# Altium schematic sheet 通讯转换模块-V5.SchDoc
size 635 x 635 mm
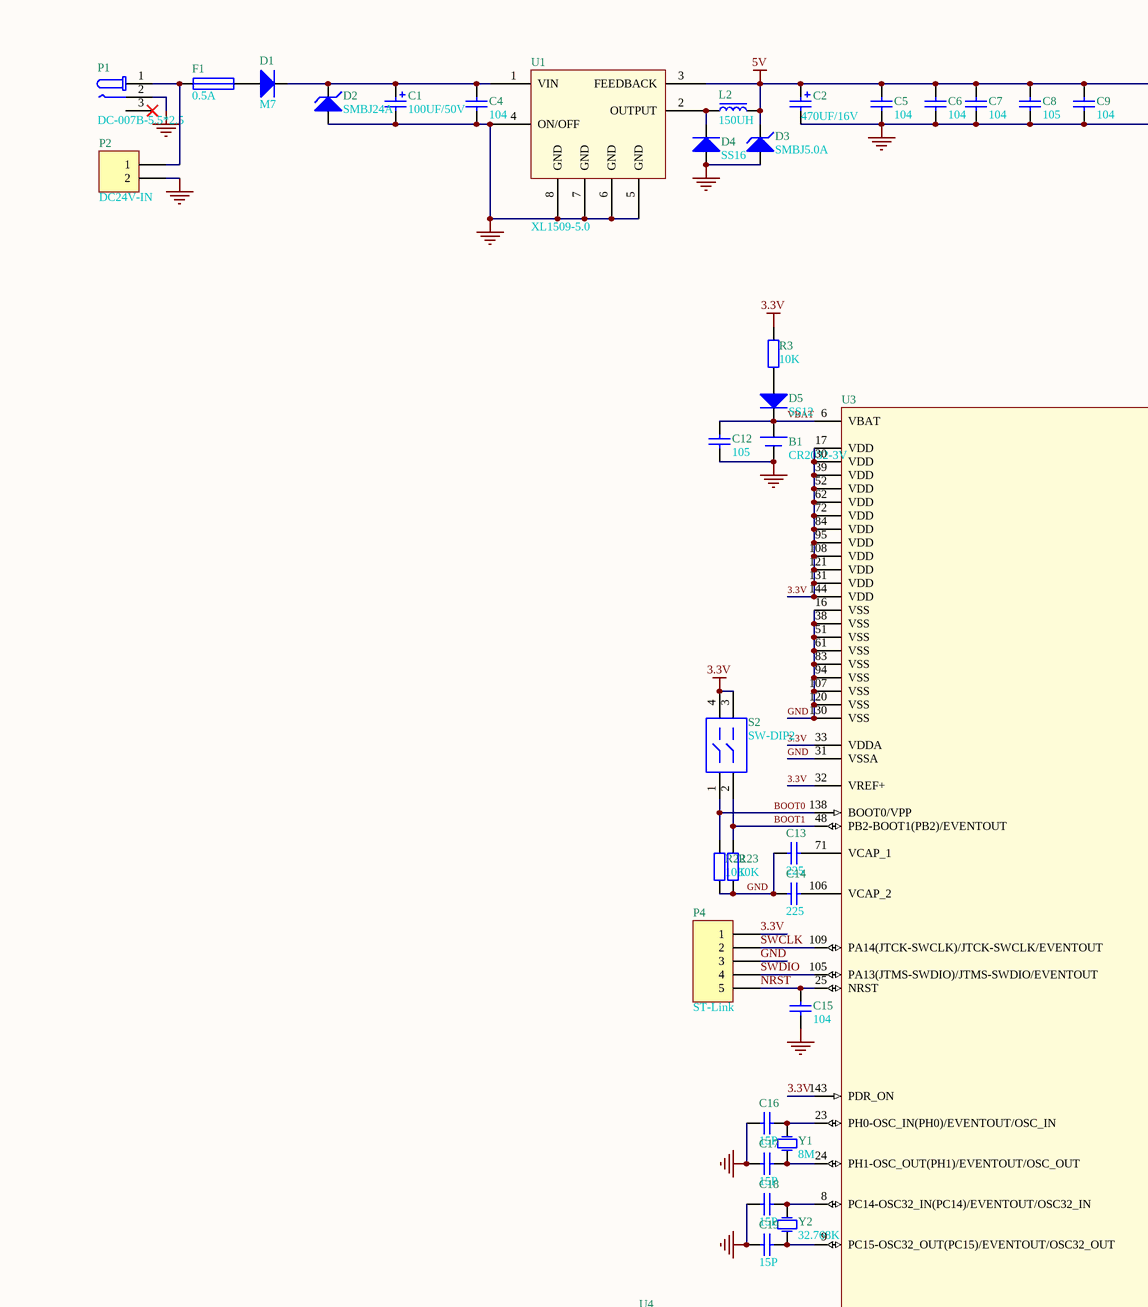
[diagram p0: 通讯转换模块-V5.SchDoc, top left]
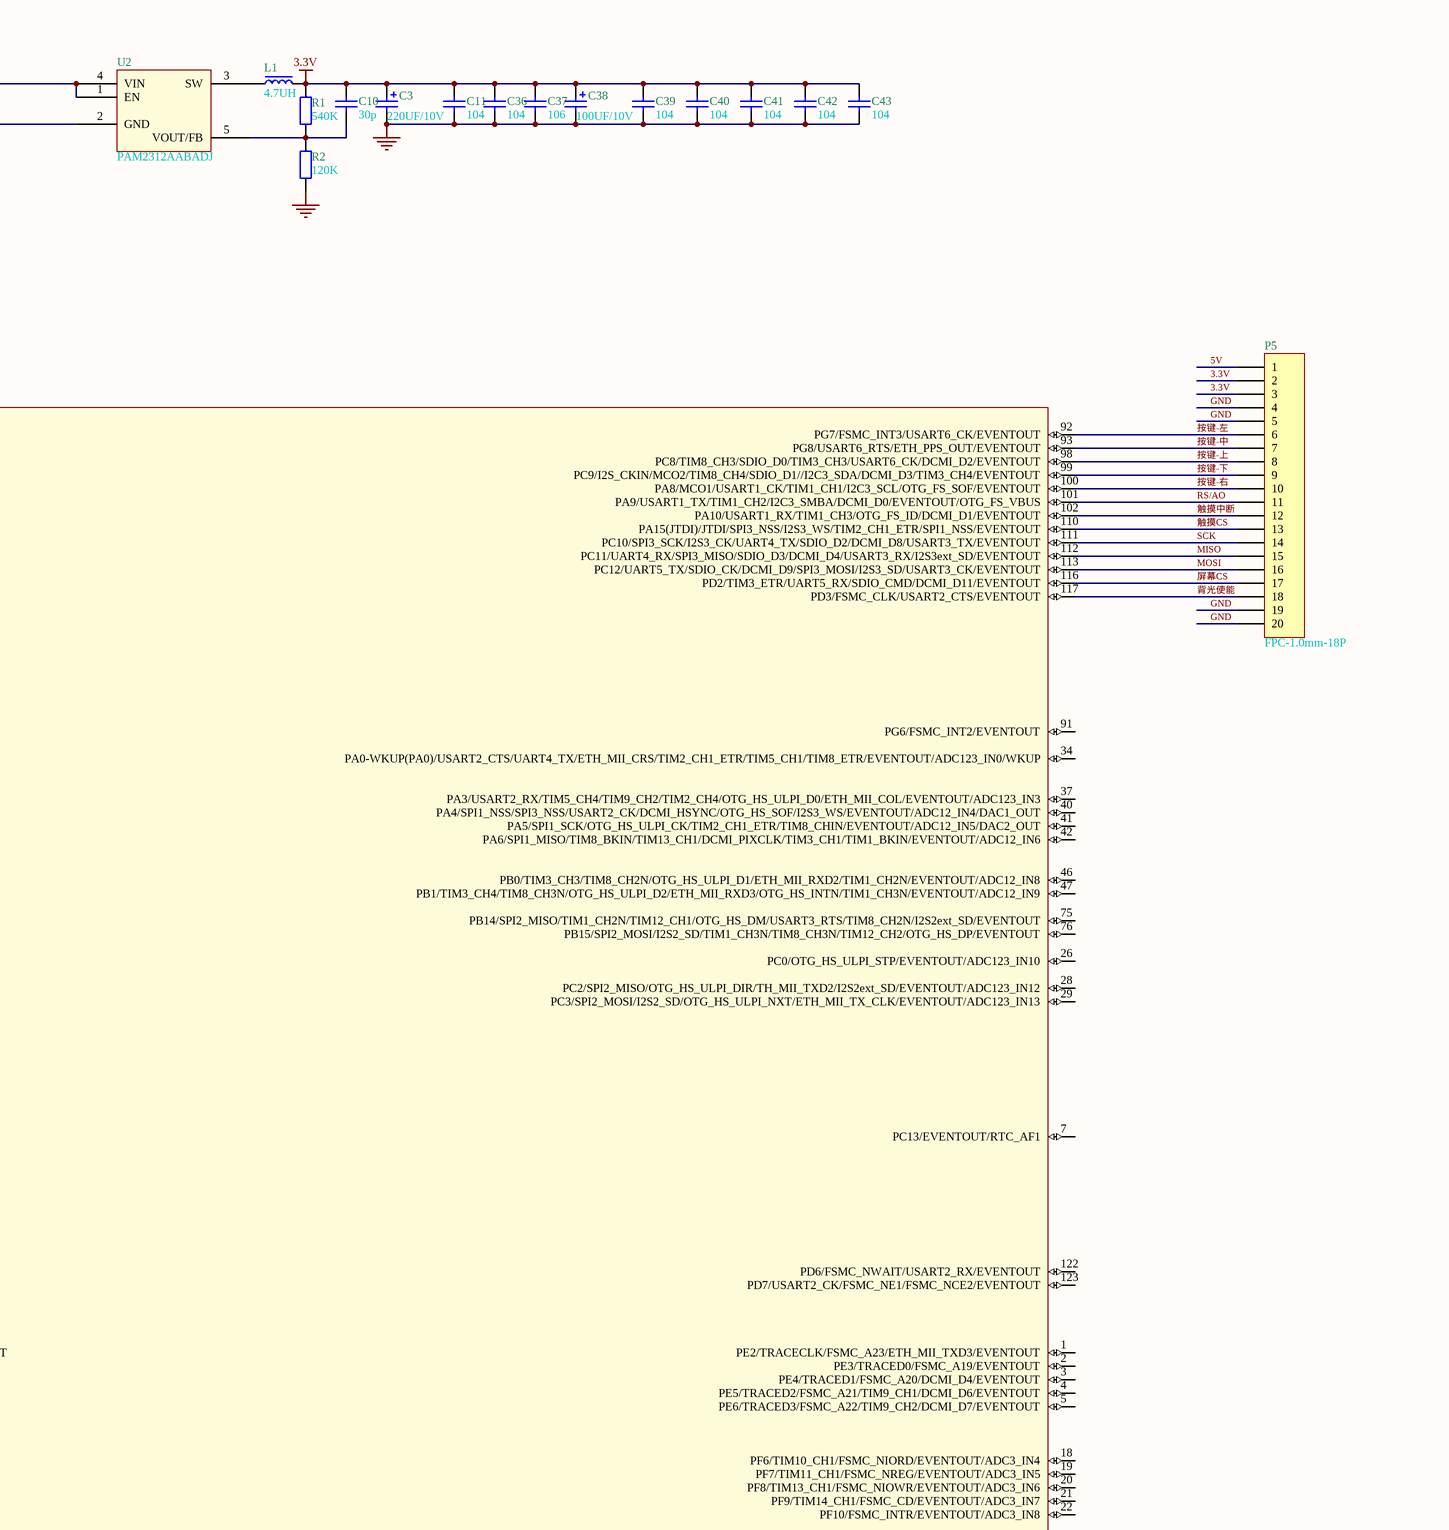
[diagram p1: 通讯转换模块-V5.SchDoc, top right]
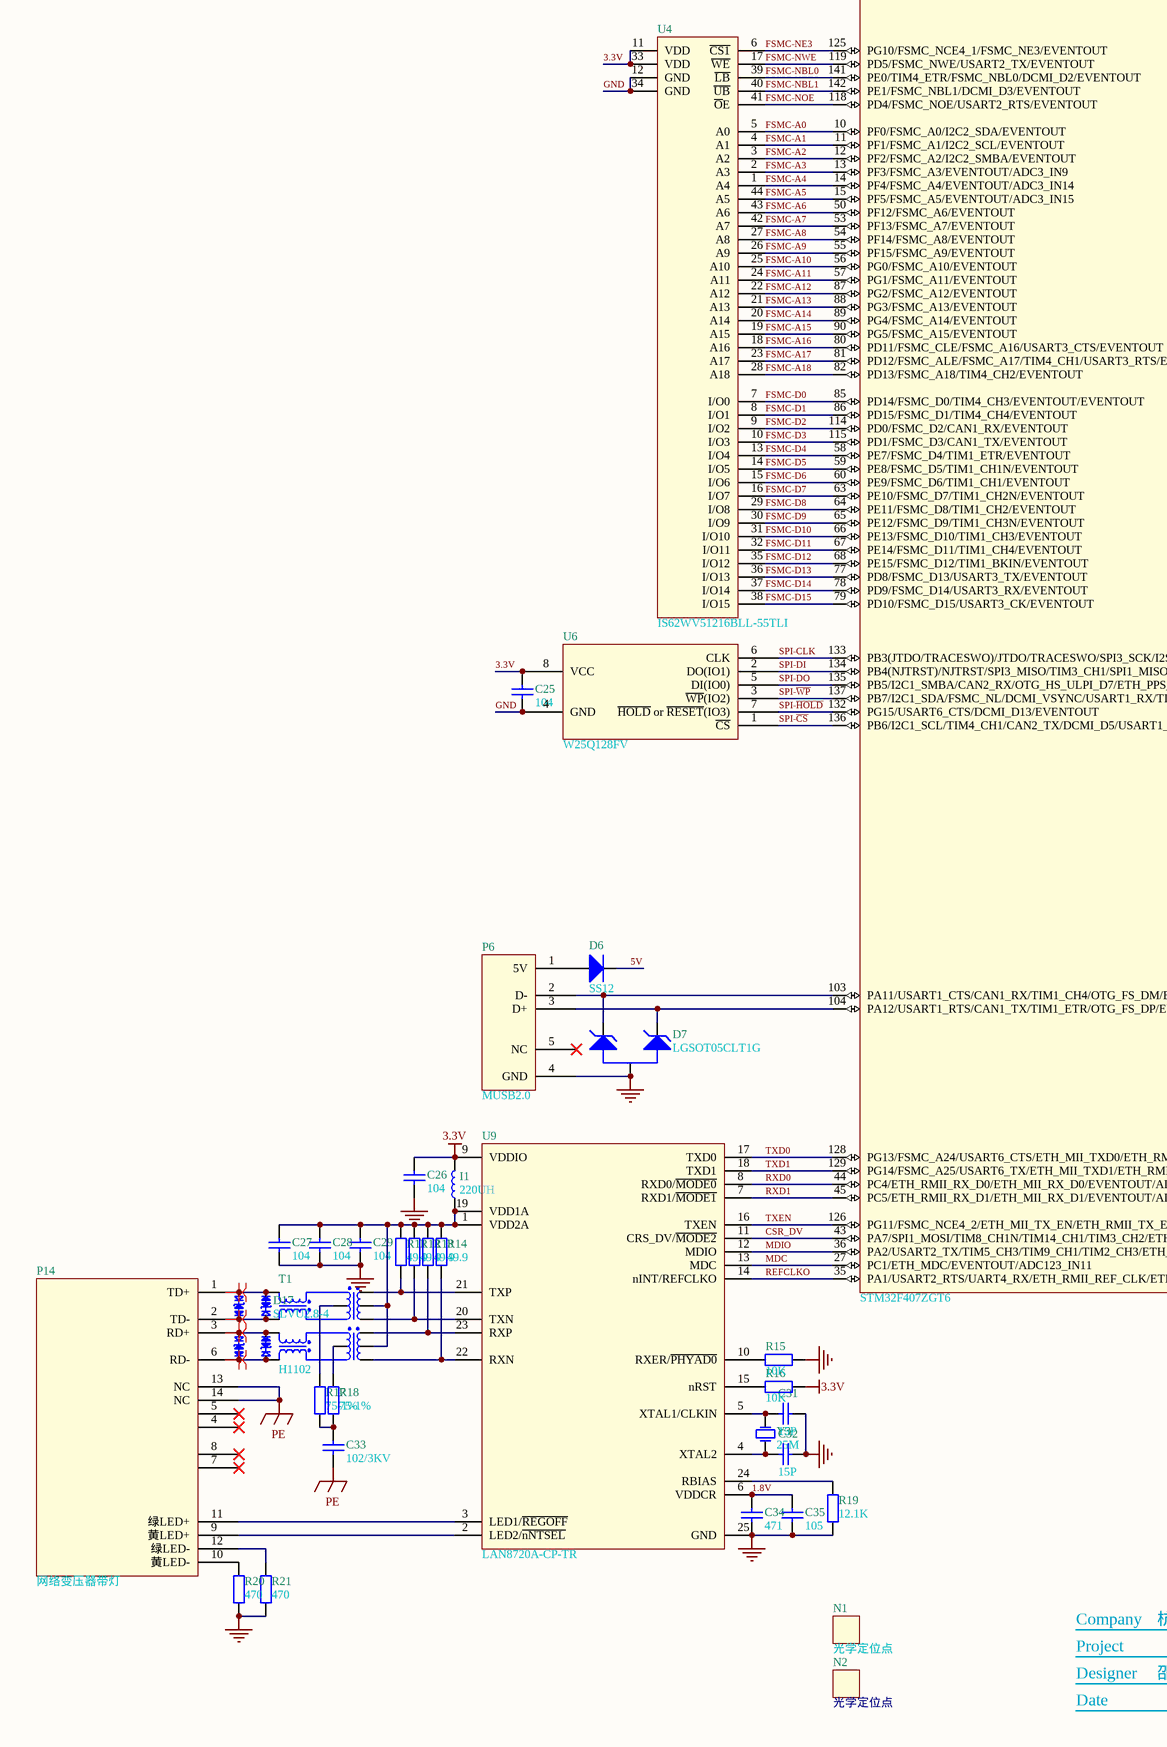
[diagram p2: 通讯转换模块-V5.SchDoc, bottom left]
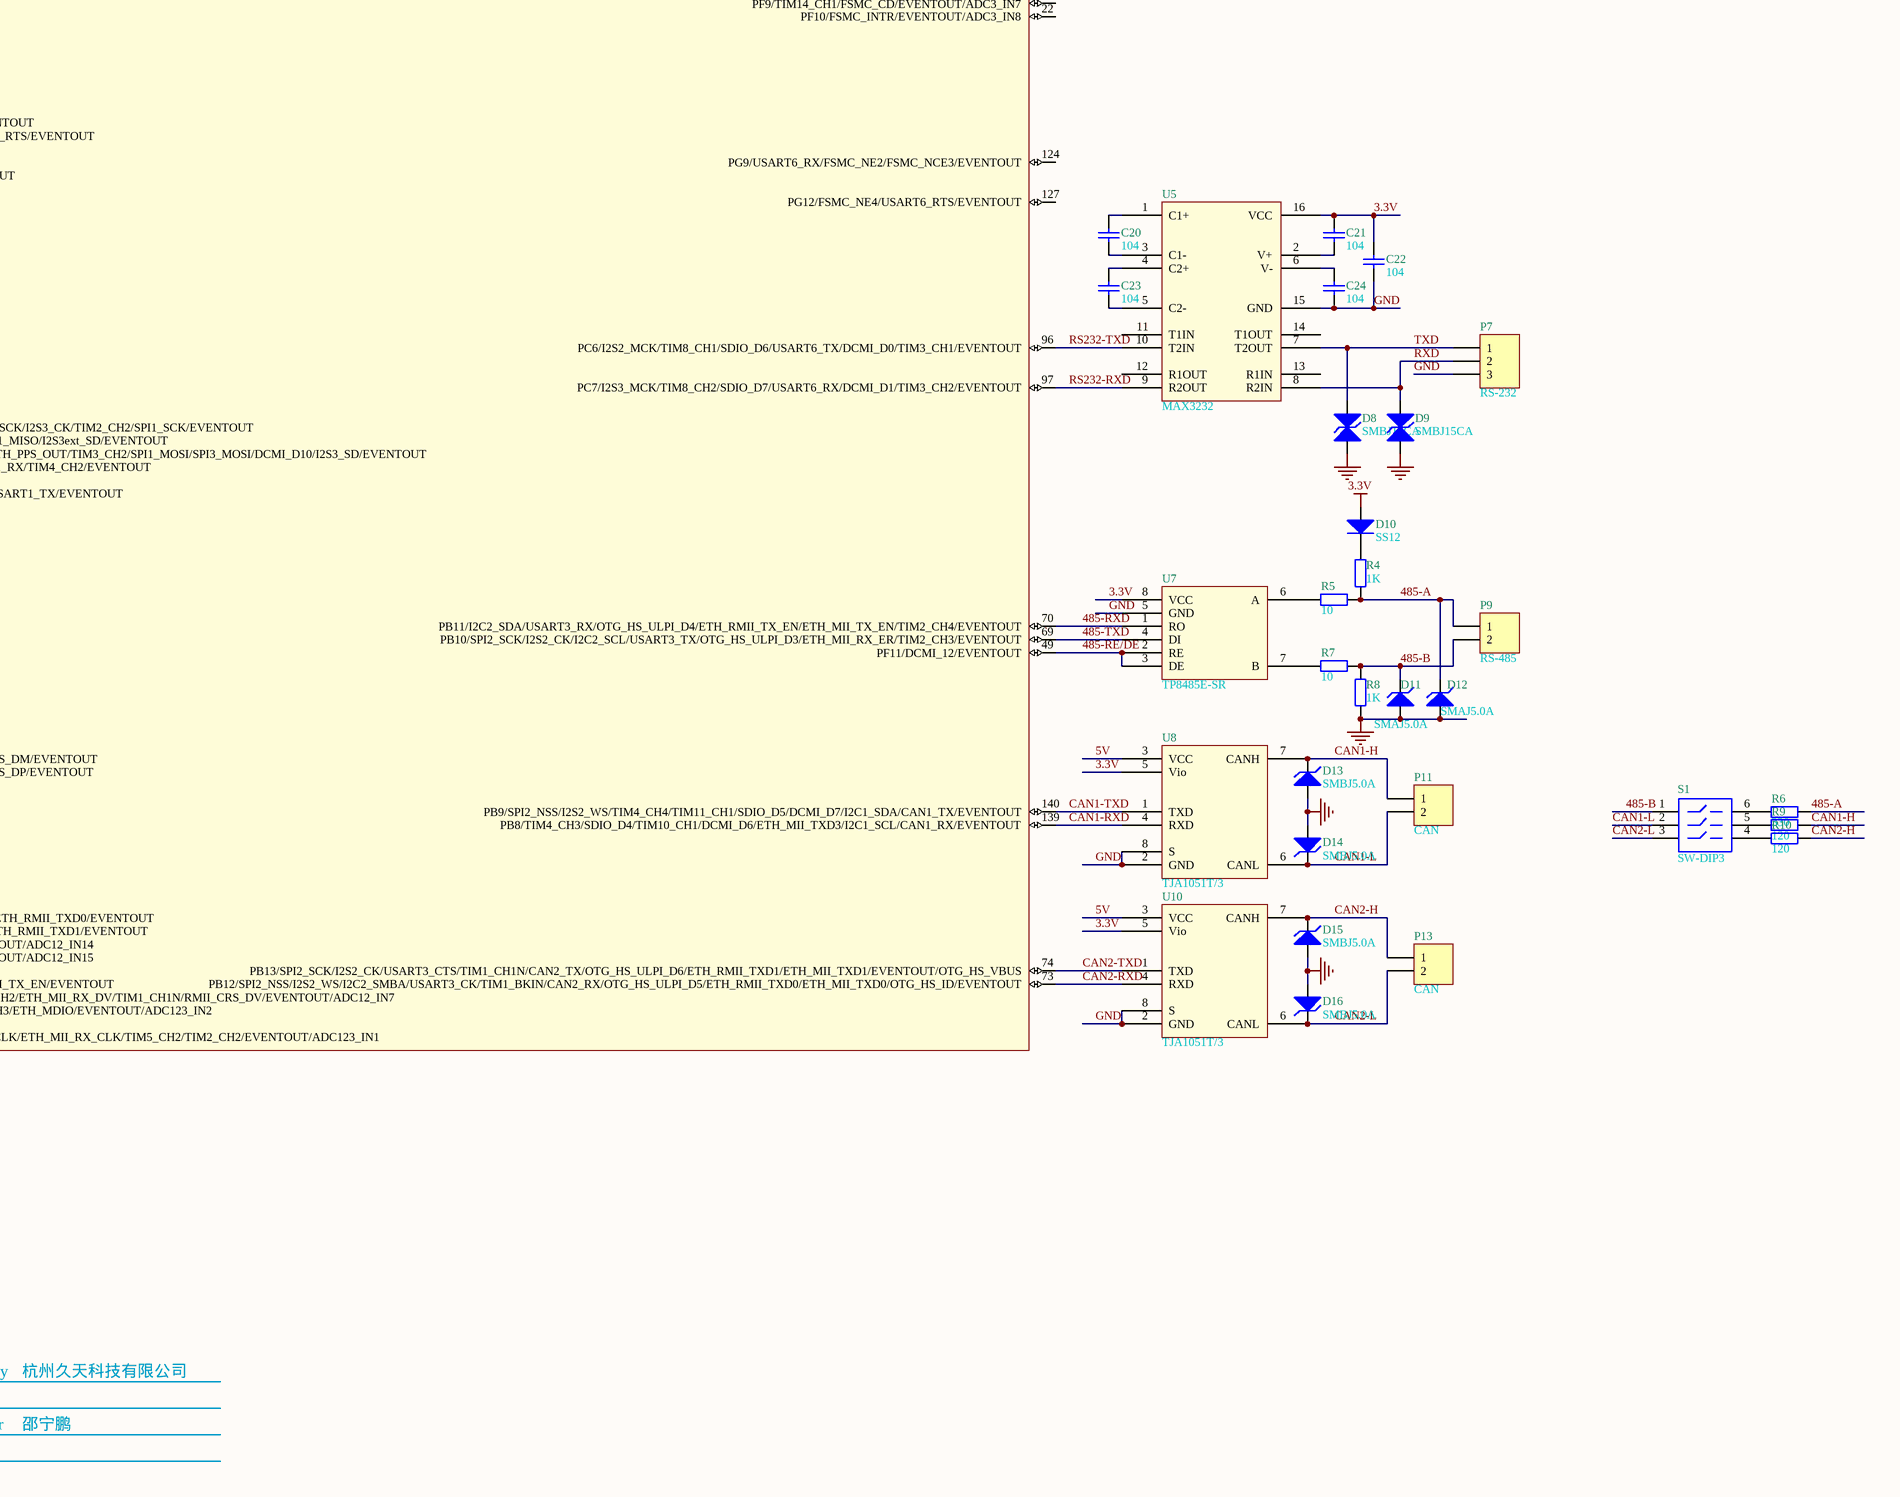
[diagram p3: 通讯转换模块-V5.SchDoc, bottom right]

## Parts
B1  CR2032-3V  [CR2032]
C1  100UF/50V  [贴片固态电容8*10]
C2  470UF/16V  [贴片固态电容8*10]
C3  220UF/10V  [贴片固态电容6.3*7.7]
C4  104  [C-0603]
C5  104  [C-0603]
C6  104  [C-0603]
C7  104  [C-0603]
C8  105  [C-0603]
C9  104  [C-0603]
C10  30p  [C-0603]
C11  104  [C-0603]
C12  105  [C-0603]
C13  225  [C-0603]
C14  225  [C-0603]
C15  104  [C-0603]
C16  15P  [C-0603]
C17  15P  [C-0603]
C18  15P  [C-0603]
C19  15P  [C-0603]
C20  104  [C-0603]
C21  104  [C-0603]
C22  104  [C-0603]
C23  104  [C-0603]
C24  104  [C-0603]
C25  104  [C-0603]
C26  104  [C-0603]
C27  104  [C-0603]
C28  104  [C-0603]
C29  104  [C-0603]
C31  15P  [C-0603]
C32  15P  [C-0603]
C33  102/3KV  [C-1206]
C34  471  [C-0603]
C35  105  [C-0603]
C36  104  [C-0603]
C37  106  [C-0603]
C38  100UF/10V  [贴片固态电容5*5.3]
C39  104  [C-0603]
C40  104  [C-0603]
C41  104  [C-0603]
C42  104  [C-0603]
C43  104  [C-0603]
D1  M7  [SMA]
D2  SMBJ24A  [SMB]
D3  SMBJ5.0A  [SMB]
D4  SS16  [SMA]
D5  SS12  [sma]
D6  SS12  [SMA]
D7  LGSOT05CLT1G  [SOT-23]
D8  SMBJ15CA  [SMB无极性]
D9  SMBJ15CA  [SMB无极性]
D10  SS12  [SMA]
D11  SMAJ5.0A  [SMB-N]
D12  SMAJ5.0A  [SMB-N]
D13  SMBJ5.0A  [SMB-N]
D14  SMBJ5.0A  [SMB-N]
D15  SMBJ5.0A  [SMB-N]
D16  SMBJ5.0A  [SMB-N]
D17  SLVU2.8-4  [SOP-8-N]
F1  0.5A  [FUSE-1808]
I1  220UH  [CD32]
L1  4.7UH  [CD54]
L2  150UH  [CD75]
N1  光学定位点  [MARK-1mm-3mm]
N2  光学定位点  [MARK-1mm-3mm]
P1  DC-007B-5.5*2.5  [DC-007B]
P2  DC24V-IN  [KF2EDG5.08V-2P-有挡边-卧式]
P4  ST-Link  [HDR1X5]
P5  FPC-1.0mm-18P  [FPC-1.0mm_18P下接翻盖]
P6  MUSB2.0  [USB1.1-插件-母座]
P7  RS-232  [KF2EDG5.08V-3P-有挡边-卧式]
P9  RS-485  [KF2EDG5.08V-2P-有挡边-卧式]
P11  CAN  [KF2EDG5.08V-2P-有挡边-卧式]
P13  CAN  [KF2EDG5.08V-2P-有挡边-卧式]
P14  网络变压器带灯  [RJ45-8P8C-56带灯]
R1  540K  [R-0603]
R2  120K  [R-0603]
R3  10K  [R-0603]
R4  1K  [R-0603]
R5  10  [R-0805]
R6  330  [R-1206]
R7  10  [R-0805]
R8  1K  [R-0603]
R9  120  [R-1206]
R10  120  [R-1206]
R11  49.9  [R-0603]
R12  49.9  [R-0603]
R13  49.9  [R-0603]
R14  49.9  [R-0603]
R15  10K  [R-0603]
R16  10K  [R-0603]
R17  75-1%  [R-0603]
R18  75-1%  [R-0603]
R19  12.1K  [R-0603]
R20  470  [R-0603]
R21  470  [R-0603]
R22  10K  [R-0603]
R23  10K  [R-0603]
S1  SW-DIP3  [SW-红色拨码开关-侧拨弯脚3P]
S2  SW-DIP2  [SW-红色拨码开关2P]
T1  H1102  [H1102]
U1  XL1509-5.0  [SOP-8-m]
U2  PAM2312AABADJ  [SOT-23-5-M]
U3  STM32F407ZGT6  [TQFP-144-L]
U4  IS62WV51216BLL-55TLI  [TSOP2-44-L]
U5  MAX3232  [SOP-16-M]
U6  W25Q128FV  [SOIC-8-M]
U7  TP8485E-SR  [SOP-8-N]
U8  TJA1051T/3  [SOP-8-N]
U9  LAN8720A-CP-TR  [QFN-24]
U10  TJA1051T/3  [SOP-8-N]
Y1  8M  [HC-49SMD]
Y2  32.768K  [FC135]
Y3  25M  [HC-49SMD]

## Nets
3.3V: C3.1 C10.2 C11.2 C21.2 C22.2 C25.2 C26.2 C36.2 C37.2 C38.1 C39.2 C40.2 C41.2 C42.2 C43.2 D10.1(A) I1.2 L1.2 P4.1 P5.2 P5.3 R1.2 R3.2 R16.2 S2.3 S2.4 U3.17(VDD) U3.30(VDD) U3.32(VREF+) U3.33(VDDA) U3.39(VDD) U3.52(VDD) U3.62(VDD) U3.72(VDD) U3.84(VDD) U3.95(VDD) U3.108(VDD) U3.121(VDD) U3.131(VDD) U3.143(PDR_ON) U3.144(VDD) U4.11(VDD) U4.33(VDD) U5.16(VCC) U6.8(VCC) U7.8(VCC) U8.5(Vio) U9.9(VDDIO) U10.5(Vio)
5V: C2.1 C5.2 C6.2 C7.2 C8.2 C9.2 D3.2(K) D6.2(K) L2.2 P5.1 U1.3(FEEDBACK) U2.1(EN) U2.4(VIN) U8.3(VCC) U10.3(VCC)
GND: B1.2(-) C1.2 C2.2 C3.2 C4.1 C5.1 C6.1 C7.1 C8.1 C9.1 C11.1 C12.1 C13.1 C14.1 C15.1 C16.2 C17.2 C18.2 C19.2 C22.1 C24.1 C25.1 C26.1 C27.1 C28.1 C29.1 C31.2 C32.2 C34.1 C35.1 C36.1 C37.1 C38.2 C39.1 C40.1 C41.1 C42.1 C43.1 D2.1(A) D3.1(A) D4.1(A) D7.3(A) D8.1(A) D9.1(A) D11.1(A) D12.1(A) D13.1(A) D14.1(A) D15.1(A) D16.1(A) P1.2 P2.2 P4.3 P5.4 P5.5 P5.19 P5.20 P6.4(GND) P7.3 R2.1 R8.1 R15.2 R19.2 R20.2 R21.1 R22.1 R23.1 U1.4(ON/OFF) U1.5(GND) U1.6(GND) U1.7(GND) U1.8(GND) U2.2(GND) U3.16(VSS) U3.31(VSSA) U3.38(VSS) U3.51(VSS) U3.61(VSS) U3.83(VSS) U3.94(VSS) U3.107(VSS) U3.120(VSS) U3.130(VSS) U4.12(GND) U4.34(GND) U5.15(GND) U6.4(GND) U7.5(GND) U8.2(GND) U8.8(S) U9.25(GND) U10.2(GND) U10.8(S)
PE: C33.2 P14.13(NC) P14.14(NC)
1.8V: C34.2 C35.2 U9.6(VDDCR)
485-A: D12.2(K) P9.1 R4.2 R5.1 R6.1
485-B: D11.2(K) P9.2 R7.1 R8.2 S1.1
485-RE/DE: U3.49(PF11/DCMI_12/EVENTOUT) U7.2(RE) U7.3(DE)
485-RXD: U3.70(PB11/I2C2_SDA/USART3_RX/OTG_HS_ULPI_D4/ETH_RMII_TX_EN/ETH_MII_TX_EN/TIM2_CH4/EVENTOUT) U7.1(RO)
485-TXD: U3.69(PB10/SPI2_SCK/I2S2_CK/I2C2_SCL/USART3_TX/OTG_HS_ULPI_D3/ETH_MII_RX_ER/TIM2_CH3/EVENTOUT) U7.4(DI)
BOOT0: R22.2 S2.1 U3.138(BOOT0/VPP)
BOOT1: R23.2 S2.2 U3.48(PB2-BOOT1(PB2)/EVENTOUT)
CAN1-H: D13.2(K) P11.1 R9.1 U8.7(CANH)
CAN1-L: D14.2(K) P11.2 S1.2 U8.6(CANL)
CAN1-RXD: U3.139(PB8/TIM4_CH3/SDIO_D4/TIM10_CH1/DCMI_D6/ETH_MII_TXD3/I2C1_SCL/CAN1_RX/EVENTOUT) U8.4(RXD)
CAN1-TXD: U3.140(PB9/SPI2_NSS/I2S2_WS/TIM4_CH4/TIM11_CH1/SDIO_D5/DCMI_D7/I2C1_SDA/CAN1_TX/EVENTOUT) U8.1(TXD)
CAN2-H: D15.2(K) P13.1 R10.1 U10.7(CANH)
CAN2-L: D16.2(K) P13.2 S1.3 U10.6(CANL)
CAN2-RXD: U3.73(PB12/SPI2_NSS/I2S2_WS/I2C2_SMBA/USART3_CK/TIM1_BKIN/CAN2_RX/OTG_HS_ULPI_D5/ETH_RMII_TXD0/ETH_MII_TXD0/OTG_HS_ID/EVENTOUT) U10.4(RXD)
CAN2-TXD: U3.74(PB13/SPI2_SCK/I2S2_CK/USART3_CTS/TIM1_CH1N/CAN2_TX/OTG_HS_ULPI_D6/ETH_RMII_TXD1/ETH_MII_TXD1/EVENTOUT/OTG_HS_VBUS) U10.1(TXD)
CSR_DV: U3.43(PA7/SPI1_MOSI/TIM8_CH1N/TIM14_CH1/TIM3_CH2/ETH_MII_RX_DV/TIM1_CH1N/RMII_CRS_DV/EVENTOUT/ADC12_IN7) U9.11(CRS_DV/~{MODE2})
FSMC-A0: U3.10(PF0/FSMC_A0/I2C2_SDA/EVENTOUT) U4.5(A0)
FSMC-A1: U3.11(PF1/FSMC_A1/I2C2_SCL/EVENTOUT) U4.4(A1)
FSMC-A2: U3.12(PF2/FSMC_A2/I2C2_SMBA/EVENTOUT) U4.3(A2)
FSMC-A3: U3.13(PF3/FSMC_A3/EVENTOUT/ADC3_IN9) U4.2(A3)
FSMC-A4: U3.14(PF4/FSMC_A4/EVENTOUT/ADC3_IN14) U4.1(A4)
FSMC-A5: U3.15(PF5/FSMC_A5/EVENTOUT/ADC3_IN15) U4.44(A5)
FSMC-A6: U3.50(PF12/FSMC_A6/EVENTOUT) U4.43(A6)
FSMC-A7: U3.53(PF13/FSMC_A7/EVENTOUT) U4.42(A7)
FSMC-A8: U3.54(PF14/FSMC_A8/EVENTOUT) U4.27(A8)
FSMC-A9: U3.55(PF15/FSMC_A9/EVENTOUT) U4.26(A9)
FSMC-A10: U3.56(PG0/FSMC_A10/EVENTOUT) U4.25(A10)
FSMC-A11: U3.57(PG1/FSMC_A11/EVENTOUT) U4.24(A11)
FSMC-A12: U3.87(PG2/FSMC_A12/EVENTOUT) U4.22(A12)
FSMC-A13: U3.88(PG3/FSMC_A13/EVENTOUT) U4.21(A13)
FSMC-A14: U3.89(PG4/FSMC_A14/EVENTOUT) U4.20(A14)
FSMC-A15: U3.90(PG5/FSMC_A15/EVENTOUT) U4.19(A15)
FSMC-A16: U3.80(PD11/FSMC_CLE/FSMC_A16/USART3_CTS/EVENTOUT) U4.18(A16)
FSMC-A17: U3.81(PD12/FSMC_ALE/FSMC_A17/TIM4_CH1/USART3_RTS/EVENTOUT) U4.23(A17)
FSMC-A18: U3.82(PD13/FSMC_A18/TIM4_CH2/EVENTOUT) U4.28(A18)
FSMC-D0: U3.85(PD14/FSMC_D0/TIM4_CH3/EVENTOUT/EVENTOUT) U4.7(I/O0)
FSMC-D1: U3.86(PD15/FSMC_D1/TIM4_CH4/EVENTOUT) U4.8(I/O1)
FSMC-D2: U3.114(PD0/FSMC_D2/CAN1_RX/EVENTOUT) U4.9(I/O2)
FSMC-D3: U3.115(PD1/FSMC_D3/CAN1_TX/EVENTOUT) U4.10(I/O3)
FSMC-D4: U3.58(PE7/FSMC_D4/TIM1_ETR/EVENTOUT) U4.13(I/O4)
FSMC-D5: U3.59(PE8/FSMC_D5/TIM1_CH1N/EVENTOUT) U4.14(I/O5)
FSMC-D6: U3.60(PE9/FSMC_D6/TIM1_CH1/EVENTOUT) U4.15(I/O6)
FSMC-D7: U3.63(PE10/FSMC_D7/TIM1_CH2N/EVENTOUT) U4.16(I/O7)
FSMC-D8: U3.64(PE11/FSMC_D8/TIM1_CH2/EVENTOUT) U4.29(I/O8)
FSMC-D9: U3.65(PE12/FSMC_D9/TIM1_CH3N/EVENTOUT) U4.30(I/O9)
FSMC-D10: U3.66(PE13/FSMC_D10/TIM1_CH3/EVENTOUT) U4.31(I/O10)
FSMC-D11: U3.67(PE14/FSMC_D11/TIM1_CH4/EVENTOUT) U4.32(I/O11)
FSMC-D12: U3.68(PE15/FSMC_D12/TIM1_BKIN/EVENTOUT) U4.35(I/O12)
FSMC-D13: U3.77(PD8/FSMC_D13/USART3_TX/EVENTOUT) U4.36(I/O13)
FSMC-D14: U3.78(PD9/FSMC_D14/USART3_RX/EVENTOUT) U4.37(I/O14)
FSMC-D15: U3.79(PD10/FSMC_D15/USART3_CK/EVENTOUT) U4.38(I/O15)
FSMC-NBL0: U3.141(PE0/TIM4_ETR/FSMC_NBL0/DCMI_D2/EVENTOUT) U4.39(~{LB})
FSMC-NBL1: U3.142(PE1/FSMC_NBL1/DCMI_D3/EVENTOUT) U4.40(~{UB})
FSMC-NE3: U3.125(PG10/FSMC_NCE4_1/FSMC_NE3/EVENTOUT) U4.6(~{CS1})
FSMC-NOE: U3.118(PD4/FSMC_NOE/USART2_RTS/EVENTOUT) U4.41(~{O}E)
FSMC-NWE: U3.119(PD5/FSMC_NWE/USART2_TX/EVENTOUT) U4.17(~{WE})
MDC: U3.27(PC1/ETH_MDC/EVENTOUT/ADC123_IN11) U9.13(MDC)
MDIO: U3.36(PA2/USART2_TX/TIM5_CH3/TIM9_CH1/TIM2_CH3/ETH_MDIO/EVENTOUT/ADC123_IN2) U9.12(MDIO)
MISO: P5.15 U3.112(PC11/UART4_RX/SPI3_MISO/SDIO_D3/DCMI_D4/USART3_RX/I2S3ext_SD/EVENTOUT)
MOSI: P5.16 U3.113(PC12/UART5_TX/SDIO_CK/DCMI_D9/SPI3_MOSI/I2S3_SD/USART3_CK/EVENTOUT)
NRST: C15.2 P4.5 U3.25(NRST)
REFCLKO: U3.35(PA1/USART2_RTS/UART4_RX/ETH_RMII_REF_CLK/ETH_MII_RX_CLK/TIM5_CH2/TIM2_CH2/EVENTOUT/ADC123_IN1) U9.14(nINT/REFCLKO)
RS232-RXD: U3.97(PC7/I2S3_MCK/TIM8_CH2/SDIO_D7/USART6_RX/DCMI_D1/TIM3_CH2/EVENTOUT) U5.9(R2OUT)
RS232-TXD: U3.96(PC6/I2S2_MCK/TIM8_CH1/SDIO_D6/USART6_TX/DCMI_D0/TIM3_CH1/EVENTOUT) U5.10(T2IN)
RS/AO: P5.11 U3.101(PA9/USART1_TX/TIM1_CH2/I2C3_SMBA/DCMI_D0/EVENTOUT/OTG_FS_VBUS)
RXD: D9.2(K) P7.2 U5.8(R2IN)
RXD0: U3.44(PC4/ETH_RMII_RX_D0/ETH_MII_RX_D0/EVENTOUT/ADC12_IN14) U9.8(RXD0/~{MODE0})
RXD1: U3.45(PC5/ETH_RMII_RX_D1/ETH_MII_RX_D1/EVENTOUT/ADC12_IN15) U9.7(RXD1/~{MODE1})
SCK: P5.14 U3.111(PC10/SPI3_SCK/I2S3_CK/UART4_TX/SDIO_D2/DCMI_D8/USART3_TX/EVENTOUT)
SPI-~{CS}: U3.136(PB6/I2C1_SCL/TIM4_CH1/CAN2_TX/DCMI_D5/USART1_TX/EVENTOUT) U6.1(~{CS})
SPI-CLK: U3.133(PB3(JTDO/TRACESWO)/JTDO/TRACESWO/SPI3_SCK/I2S3_CK/TIM2_CH2/SPI1_SCK/EVENTOUT) U6.6(CLK)
SPI-DI: U3.134(PB4(NJTRST)/NJTRST/SPI3_MISO/TIM3_CH1/SPI1_MISO/I2S3ext_SD/EVENTOUT) U6.2(DO(IO1))
SPI-DO: U3.135(PB5/I2C1_SMBA/CAN2_RX/OTG_HS_ULPI_D7/ETH_PPS_OUT/TIM3_CH2/SPI1_MOSI/SPI3_MOSI/DCMI_D10/I2S3_SD/EVENTOUT) U6.5(DI(IO0))
SPI-~{HOLD}: U3.132(PG15/USART6_CTS/DCMI_D13/EVENTOUT) U6.7(~{HOLD}_or_~{RESET}(IO3))
SPI-~{WP}: U3.137(PB7/I2C1_SDA/FSMC_NL/DCMI_VSYNC/USART1_RX/TIM4_CH2/EVENTOUT) U6.3(~{WP}(IO2))
SWCLK: P4.2 U3.109(PA14(JTCK-SWCLK)/JTCK-SWCLK/EVENTOUT)
SWDIO: P4.4 U3.105(PA13(JTMS-SWDIO)/JTMS-SWDIO/EVENTOUT)
TXD: D8.2(K) P7.1 U5.7(T2OUT)
TXD0: U3.128(PG13/FSMC_A24/USART6_CTS/ETH_MII_TXD0/ETH_RMII_TXD0/EVENTOUT) U9.17(TXD0)
TXD1: U3.129(PG14/FSMC_A25/USART6_TX/ETH_MII_TXD1/ETH_RMII_TXD1/EVENTOUT) U9.18(TXD1)
TXEN: U3.126(PG11/FSMC_NCE4_2/ETH_MII_TX_EN/ETH_RMII_TX_EN/EVENTOUT) U9.16(TXEN)
VBAT: B1.1(+) C12.2 D5.2(K) U3.6(VBAT)
屏幕CS: P5.17 U3.116(PD2/TIM3_ETR/UART5_RX/SDIO_CMD/DCMI_D11/EVENTOUT)
按键-上: P5.8 U3.98(PC8/TIM8_CH3/SDIO_D0/TIM3_CH3/USART6_CK/DCMI_D2/EVENTOUT)
按键-下: P5.9 U3.99(PC9/I2S_CKIN/MCO2/TIM8_CH4/SDIO_D1//I2C3_SDA/DCMI_D3/TIM3_CH4/EVENTOUT)
按键-中: P5.7 U3.93(PG8/USART6_RTS/ETH_PPS_OUT/EVENTOUT)
按键-右: P5.10 U3.100(PA8/MCO1/USART1_CK/TIM1_CH1/I2C3_SCL/OTG_FS_SOF/EVENTOUT)
按键-左: P5.6 U3.92(PG7/FSMC_INT3/USART6_CK/EVENTOUT)
背光使能: P5.18 U3.117(PD3/FSMC_CLK/USART2_CTS/EVENTOUT)
触摸CS: P5.13 U3.110(PA15(JTDI)/JTDI/SPI3_NSS/I2S3_WS/TIM2_CH1_ETR/SPI1_NSS/EVENTOUT)
触摸中断: P5.12 U3.102(PA10/USART1_RX/TIM1_CH3/OTG_FS_ID/DCMI_D1/EVENTOUT)
NetC1_1: C1.1 C4.2 D1.2(K) D2.2(K) U1.1(VIN)
NetC10_1: C10.1 R1.1 R2.2 U2.5(VOUT/FB)
NetC13_2: C13.2 U3.71(VCAP_1)
NetC14_2: C14.2 U3.106(VCAP_2)
NetC16_1: C16.1 U3.23(PH0-OSC_IN(PH0)/EVENTOUT/OSC_IN) Y1.2(OSC2)
NetC17_1: C17.1 U3.24(PH1-OSC_OUT(PH1)/EVENTOUT/OSC_OUT) Y1.1(OSC1)
NetC18_1: C18.1 U3.8(PC14-OSC32_IN(PC14)/EVENTOUT/OSC32_IN) Y2.2(OSC2)
NetC19_1: C19.1 U3.9(PC15-OSC32_OUT(PC15)/EVENTOUT/OSC32_OUT) Y2.1(OSC1)
NetC20_1: C20.1 U5.3(C1-)
NetC20_2: C20.2 U5.1(C1+)
NetC21_1: C21.1 U5.2(V+)
NetC23_1: C23.1 U5.5(C2-)
NetC23_2: C23.2 U5.4(C2+)
NetC24_2: C24.2 U5.6(V-)
NetC27_2: C27.2 C28.2 C29.2 I1.1 R11.2 R12.2 R13.2 R14.2 T1.2 T1.7 U9.1(VDD2A) U9.19(VDD1A)
NetC31_1: C31.1 U9.5(XTAL1/CLKIN) Y3.2(OSC2)
NetC32_1: C32.1 U9.4(XTAL2) Y3.1(OSC1)
NetC33_1: C33.1 R17.1 R18.2
NetD1_1: D1.1(A) F1.2
NetD4_2: D4.2(K) L2.1 U1.2(OUTPUT)
NetD5_1: D5.1(A) R3.1
NetD6_1: D6.1(A) P6.1(5V)
NetD7_1: D7.1(K) P6.3(D+) U3.104(PA12/USART1_RTS/CAN1_TX/TIM1_ETR/OTG_FS_DP/EVENTOUT)
NetD7_2: D7.2(K) P6.2(D-) U3.103(PA11/USART1_CTS/CAN1_RX/TIM1_CH4/OTG_FS_DM/EVENTOUT)
NetD10_2: D10.2(K) R4.1
NetD17_1: D17.1 D17.8 P14.1(TD+) T1.16
NetD17_2: D17.2 D17.7 P14.2(TD-) T1.14
NetD17_3: D17.3 D17.6 P14.3(RD+) T1.11
NetD17_4: D17.4 D17.5 P14.6(RD-) T1.9
NetF1_1: F1.1 P1.1 P2.1
NetL1_1: L1.1 U2.3(SW)
NetP14_9: P14.9(黄LED+) U9.2(LED2/~{nNTSEL})
NetP14_10: P14.10(黄LED-) R20.1
NetP14_11: P14.11(绿LED+) U9.3(LED1/~{REGOFF})
NetP14_12: P14.12(绿LED-) R21.2
NetR5_2: R5.2 U7.6(A)
NetR6_2: R6.2 S1.6
NetR7_2: R7.2 U7.7(B)
NetR9_2: R9.2 S1.5
NetR10_2: R10.2 S1.4
NetR11_1: R11.1 T1.1 U9.21(TXP)
NetR12_1: R12.1 T1.3 U9.20(TXN)
NetR13_1: R13.1 T1.6 U9.23(RXP)
NetR14_1: R14.1 T1.8 U9.22(RXN)
NetR15_1: R15.1 U9.10(RXER/~{PHYAD0})
NetR16_1: R16.1 U9.15(nRST)
NetR17_2: R17.2 T1.15
NetR18_1: R18.1 T1.10
NetR19_1: R19.1 U9.24(RBIAS)

Not connected (* = marked no-connect by the designer): P1 3(NC)*; P6 5(NC)*; P14 4* 5* 7* 8*; U3 1(PE2/TRACECLK/FSMC_A23/ETH_MII_TXD3/EVENTOUT) 2(PE3/TRACED0/FSMC_A19/EVENTOUT) 3(PE4/TRACED1/FSMC_A20/DCMI_D4/EVENTOUT) 4(PE5/TRACED2/FSMC_A21/TIM9_CH1/DCMI_D6/EVENTOUT) 5(PE6/TRACED3/FSMC_A22/TIM9_CH2/DCMI_D7/EVENTOUT) 7(PC13/EVENTOUT/RTC_AF1) 18(PF6/TIM10_CH1/FSMC_NIORD/EVENTOUT/ADC3_IN4) 19(PF7/TIM11_CH1/FSMC_NREG/EVENTOUT/ADC3_IN5) 20(PF8/TIM13_CH1/FSMC_NIOWR/EVENTOUT/ADC3_IN6) 21(PF9/TIM14_CH1/FSMC_CD/EVENTOUT/ADC3_IN7) 22(PF10/FSMC_INTR/EVENTOUT/ADC3_IN8) 26(PC0/OTG_HS_ULPI_STP/EVENTOUT/ADC123_IN10) 28(PC2/SPI2_MISO/OTG_HS_ULPI_DIR/TH_MII_TXD2/I2S2ext_SD/EVENTOUT/ADC123_IN12) 29(PC3/SPI2_MOSI/I2S2_SD/OTG_HS_ULPI_NXT/ETH_MII_TX_CLK/EVENTOUT/ADC123_IN13) 34(PA0-WKUP(PA0)/USART2_CTS/UART4_TX/ETH_MII_CRS/TIM2_CH1_ETR/TIM5_CH1/TIM8_ETR/EVENTOUT/ADC123_IN0/WKUP) 37(PA3/USART2_RX/TIM5_CH4/TIM9_CH2/TIM2_CH4/OTG_HS_ULPI_D0/ETH_MII_COL/EVENTOUT/ADC123_IN3) 40(PA4/SPI1_NSS/SPI3_NSS/USART2_CK/DCMI_HSYNC/OTG_HS_SOF/I2S3_WS/EVENTOUT/ADC12_IN4/DAC1_OUT) 41(PA5/SPI1_SCK/OTG_HS_ULPI_CK/TIM2_CH1_ETR/TIM8_CHIN/EVENTOUT/ADC12_IN5/DAC2_OUT) 42(PA6/SPI1_MISO/TIM8_BKIN/TIM13_CH1/DCMI_PIXCLK/TIM3_CH1/TIM1_BKIN/EVENTOUT/ADC12_IN6) 46(PB0/TIM3_CH3/TIM8_CH2N/OTG_HS_ULPI_D1/ETH_MII_RXD2/TIM1_CH2N/EVENTOUT/ADC12_IN8) 47(PB1/TIM3_CH4/TIM8_CH3N/OTG_HS_ULPI_D2/ETH_MII_RXD3/OTG_HS_INTN/TIM1_CH3N/EVENTOUT/ADC12_IN9) 75(PB14/SPI2_MISO/TIM1_CH2N/TIM12_CH1/OTG_HS_DM/USART3_RTS/TIM8_CH2N/I2S2ext_SD/EVENTOUT) 76(PB15/SPI2_MOSI/I2S2_SD/TIM1_CH3N/TIM8_CH3N/TIM12_CH2/OTG_HS_DP/EVENTOUT) 91(PG6/FSMC_INT2/EVENTOUT) 122(PD6/FSMC_NWAIT/USART2_RX/EVENTOUT) 123(PD7/USART2_CK/FSMC_NE1/FSMC_NCE2/EVENTOUT) 124(PG9/USART6_RX/FSMC_NE2/FSMC_NCE3/EVENTOUT) 127(PG12/FSMC_NE4/USART6_RTS/EVENTOUT); U5 11(T1IN) 12(R1OUT) 13(R1IN) 14(T1OUT)

## Layout directives
differential pair: (no net found under the mark)

## Notes on the sheet
- Project
- Company
- 杭州久天科技有限公司
- Designer
- Date
- 邵宁鹏

## Library data of the parts
B1 = Battery1: 锂电池
C1-C3 C38 = Cap Pol1: 电解电容; Published: 8-Jun-2000; LatestRevisionDate: 17-Jul-2002; LatestRevisionNote: Re-released for DXP Platform.; PackageReference: RB7.6-15; Publisher: Altium Limited
C4-C11 C20-C24 C33 C36 C37 C39-C43 = Cap-0805: 0805; Published: 8-Jun-2000; LatestRevisionDate: 17-Jul-2002; LatestRevisionNote: Re-released for DXP Platform.; PackageReference: RAD-0.3; Publisher: Altium Limited
C12-C19 C25-C29 C31 C32 C34 C35 = Cap-0603: 0805; Published: 8-Jun-2000; LatestRevisionDate: 17-Jul-2002; LatestRevisionNote: Re-released for DXP Platform.; PackageReference: RAD-0.3; Publisher: Altium Limited
D1 = M7: SMA; Published: 8-Jun-2000; LatestRevisionDate: 17-Jul-2002; LatestRevisionNote: Re-released for DXP Platform.; DatasheetVersion: 1989; PackageVersion: 1989; PackageReference: DO-35A; Publisher: Altium Limited; Code_JEDEC: DO-204-AH; ComponentLink1Description: Manufacturer Link; ComponentLink1URL: http://www.national.com/
D2 D3 D11-D16 = TVS-1: SMB
D4-D6 D10 = SS14: SMA
D7 = ESDA5V3L: ESD
D8 D9 = TVS-2: SMB
F1 = Fuse 1: Fuse; Published: 8-Jun-2000; LatestRevisionDate: 17-Jul-2002; LatestRevisionNote: Re-released for DXP Platform.; PackageReference: PIN-W2/E2.8; Publisher: Altium Limited
I1 = Inductance1
L1 L2 = Inductance3
N1 N2 = 无引脚
P1 = DC-007B
P2 P9 P11 P13 = Header 2: Header, 2-Pin; LatestRevisionDate: 17-Jul-2002; LatestRevisionNote: Re-released for DXP Platform.; Publisher: Altium Limited
P4 = Header 5: Header, 5-Pin; LatestRevisionDate: 17-Jul-2002; LatestRevisionNote: Re-released for DXP Platform.; Publisher: Altium Limited
P5 = Header 20: Header, 20-Pin; LatestRevisionDate: 17-Jul-2002; LatestRevisionNote: Re-released for DXP Platform.; Publisher: Altium Limited
P6 = USB-4_A
P7 = Header 3: Header, 3-Pin; LatestRevisionDate: 17-Jul-2002; LatestRevisionNote: Re-released for DXP Platform.; Publisher: Altium Limited
R1-R3 R15 R16 R19-R23 = Res2-0603: 0603; Published: 8-Jun-2000; LatestRevisionDate: 17-Jul-2002; LatestRevisionNote: Re-released for DXP Platform.; PackageReference: AXIAL-0.4; Publisher: Altium Limited
R4 R8 R11-R14 = Res2: Resistor; Published: 8-Jun-2000; LatestRevisionDate: 17-Jul-2002; LatestRevisionNote: Re-released for DXP Platform.; PackageReference: AXIAL-0.4; Publisher: Altium Limited
R5-R7 R9 R10 = Res2: Resistor; Value: 1K; Published: 8-Jun-2000; LatestRevisionDate: 17-Jul-2002; LatestRevisionNote: Re-released for DXP Platform.; PackageReference: AXIAL-0.4; Publisher: Altium Limited
R17 R18 = Res2-0805: 0805; Published: 8-Jun-2000; LatestRevisionDate: 17-Jul-2002; LatestRevisionNote: Re-released for DXP Platform.; PackageReference: AXIAL-0.4; Publisher: Altium Limited
U1 = XL1509-ADJ: 开关电源 SOP-8
U2 = PAM2312: 开关电源 SOT-23-5
U3 = STM32F407ZET6
U6 = W25Q128FV: SPI-FLASH
U7 = MAX3082: RS485总线转串口
U9 = LAN8720A-CP-TR: 以太网PHY
Y1-Y3 = 晶振
S1 = SW-DIP3: Published: 24-Mar-1999; LatestRevisionDate: 17-Dec-2003; LatestRevisionNote: PCB Footprint replaced.; PackageReference: DIP-16-KEY; Publisher: Altium Limited; ComponentLink1Description: Manufacturer Link; ComponentLink1URL: http://www.oupiin.com/prodindx.html#Headers
S2 = SW-DIP2: Published: 24-Mar-1999; LatestRevisionDate: 17-Dec-2003; LatestRevisionNote: PCB Footprint replaced.; PackageReference: DIP-16-KEY; Publisher: Altium Limited; ComponentLink1Description: Manufacturer Link; ComponentLink1URL: http://www.oupiin.com/prodindx.html#Headers